# Altium schematic sheet Mobile_device_sheet5_power_supply.SchDoc
size A4; SheetNumber: 4; SheetTotal: 5
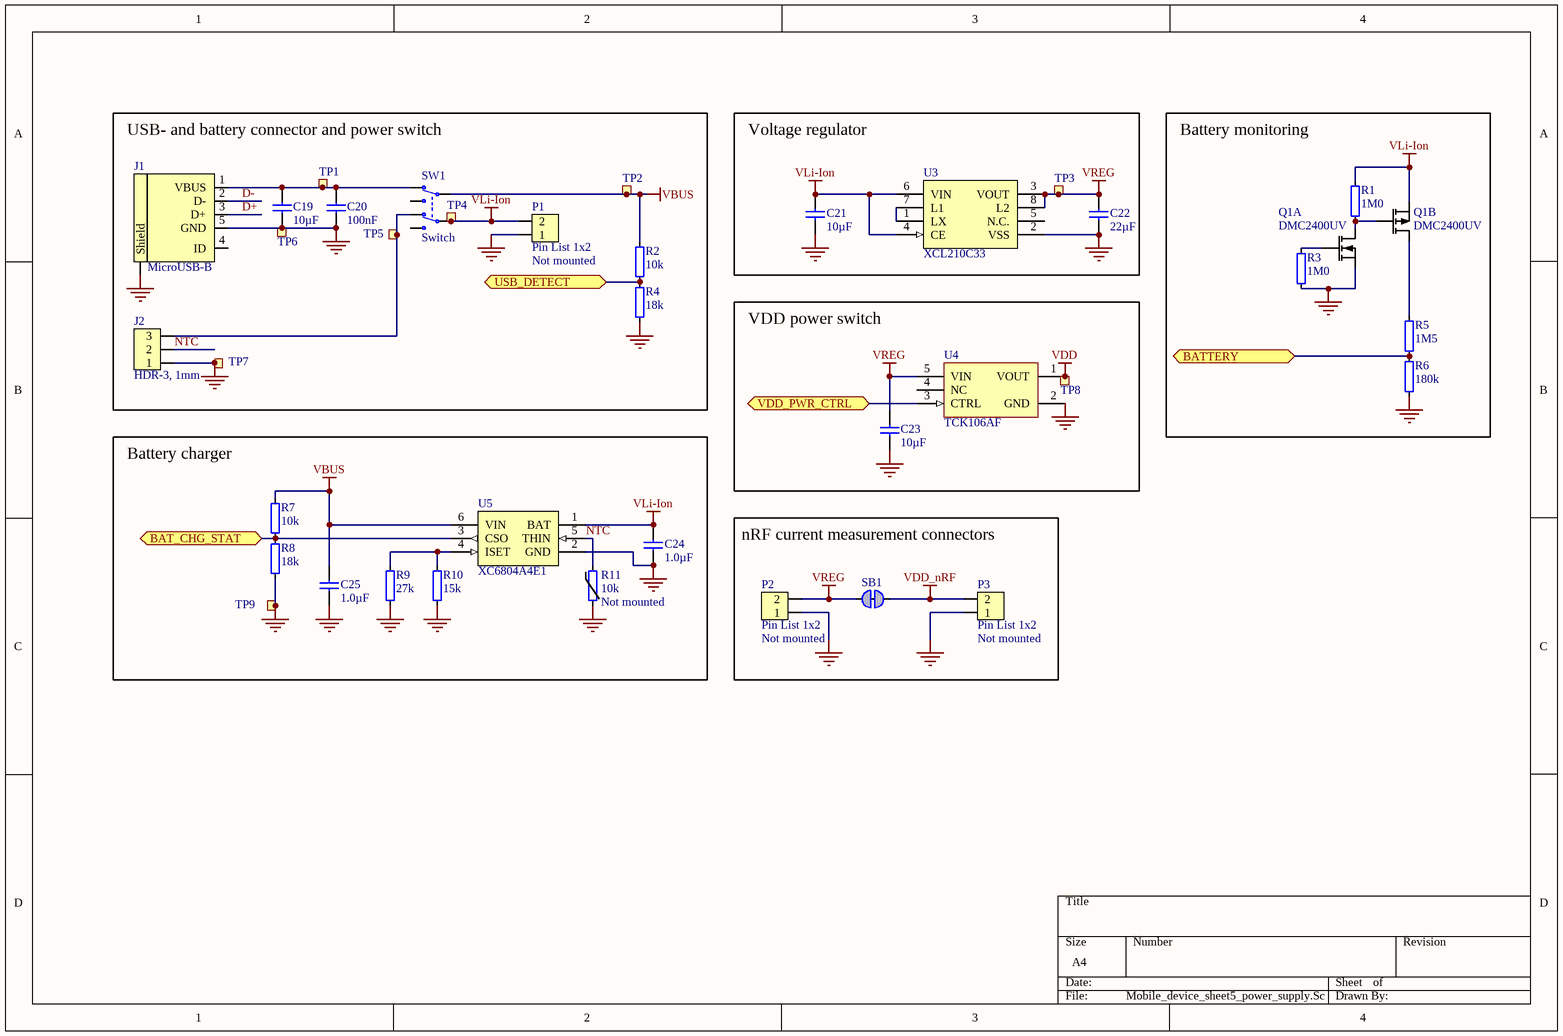
[diagram p0: Mobile_device_sheet5_power_supply.SchDoc]

## Parts
C19  10µF  [CAPC1608X06L]
C20  100nF  [CAPC1005X04L]
C21  10µF  [CAPC1608X06L]
C22  22µF  [CAPC1608X06L]
C23  10µF  [CAPC1608X06L]
C24  1.0µF  [CAPC1608X06L]
C25  1.0µF  [CAPC1608X06L]
J1  MicroUSB-B  [USB-Micro-B-RA-SMD-PiP]
J2  HDR-3, 1mm  [SM03B-SRSS-TB]
P1  Pin List 1x2  Assembly: Not mounted  [LIST_1x2-NC]
P2  Pin List 1x2  Assembly: Not mounted  [LIST_1x2-NC]
P3  Pin List 1x2  Assembly: Not mounted  [LIST_1x2-NC]
Q1  DMC2400UV  [SOTFL50P162X60-6N]  (parts A,B of 2)
R1  1M0  [RESC1005X04L]
R2  10k  [RESC1005X04L]
R3  1M0  [RESC1005X04L]
R4  18k  [RESC1005X04L]
R5  1M5  [RESC1005X04L]
R6  180k  [RESC1005X04L]
R7  10k  [RESC1005X04L]
R8  18k  [RESC1005X04L]
R9  27k  [RESC1005X04L]
R10  15k  [RESC1005X04L]
R11  10k  Assembly: Not mounted  [RESC1005X04L]
SB1  Solderbridge  [Solderbridge_Shorted]  (value not drawn)  (net tie, no BOM)
SW1  Switch  [Switch-Slide-RA-J-Lead-DPDT-8.5x3.5mm]
TP1  Ø1.5mm,SMD  [TP_SMD_Ø1.5mm]  (value not drawn)  (no BOM)
TP2  Ø1.5mm,SMD  [TP_SMD_Ø1.5mm]  (value not drawn)  (no BOM)
TP3  Ø1.5mm,SMD  [TP_SMD_Ø1.5mm]  (value not drawn)  (no BOM)
TP4  Ø1.5mm,SMD  [TP_SMD_Ø1.5mm]  (value not drawn)  (no BOM)
TP5  Ø1.5mm,SMD  [TP_SMD_Ø1.5mm]  (value not drawn)  (no BOM)
TP6  Ø1.5mm,SMD  [TP_SMD_Ø1.5mm]  (value not drawn)  (no BOM)
TP7  Ø1.5mm,SMD  [TP_SMD_Ø1.5mm]  (value not drawn)  (no BOM)
TP8  Ø1.5mm,SMD  [TP_SMD_Ø1.5mm]  (value not drawn)  (no BOM)
TP9  TP  [TESTPAD-TH]  (value not drawn)  (no BOM)
U3  XCL210C33  [CL-2025]
U4  TCK106AF  [SOT95P280X140-5N]
U5  XC6804A4E1  [USP-6EL]

## Blocks framed on the sheet
USB- and battery connector and power switch: C19 C20 J1 J2 P1 R2 R4 SW1 TP1 TP2 TP4-TP7
Voltage regulator: C21 C22 TP3 U3
Battery monitoring: Q1 R1 R3 R5 R6
VDD power switch: C23 TP8 U4
Battery charger: C24 C25 R7-R11 TP9 U5
nRF current measurement connectors: P2 P3 SB1

## Ports
BAT_CHG_STAT (bidir), BATTERY (bidir), USB_DETECT (bidir), VDD_PWR_CTRL (bidir)

## Nets
GND: C19.2 C20.2 C21.1 C22.1 C23.1 C24.1 C25.1 J1.5(GND) J1.6(Shield) J2.1 P1.1 P2.1 P3.1 Q1.1(S1) R3.2 R4.2 R6.2 R8.2 R9.2 R10.2 R11.2 TP6.1 TP7.1 TP9.1 U3.2(VSS) U3.9(VSS) U4.2(GND) U5.2(GND) U5.7(GND)
VBUS: C25.2 R2.1 R7.1 SW1.2(COM-1) TP2.1 U5.6(VIN)
VDD: TP8.1 U4.1(VOUT)
VDD_nRF: P3.2 SB1.1
VLi-Ion: C21.2 C24.2 P1.2 Q1.4(S2) R1.1 SW1.5(COM-2) TP4.1 U3.4(CE) U3.6(VIN) U5.1(BAT)
VREG: C22.2 C23.2 P2.2 SB1.2 TP3.1 U3.3(VOUT) U3.8(L2) U4.5(VIN)
BAT_CHG_STAT: R7.2 R8.1 U5.3(CSO) ; port BAT_CHG_STAT
BATTERY: R5.2 R6.1 ; port BATTERY
D+: J1.3(D+)
D-: J1.2(D-)
NTC: J2.2 R11.1 U5.5(THIN)
USB_DETECT: R2.2 R4.1 ; port USB_DETECT
VDD_PWR_CTRL: U4.3(CTRL) ; port VDD_PWR_CTRL
NetC19_1: C19.1 C20.1 J1.1(VBUS) SW1.3(N.C-1) TP1.1
NetJ2_3: J2.3 SW1.6(N.C-2) TP5.1
NetQ1_2: Q1.2(G1) R3.1
NetQ1_3: Q1.3(D2) R5.1
NetQ1_5: Q1.5(G2) Q1.6(D1) R1.2
NetR9_1: R9.1 R10.1 U5.4(ISET)
NetU3_1: U3.1(LX) U3.7(L1)

Not connected (* = marked no-connect by the designer): J1 4(ID); SW1 1(N.O-1) 4(N.O-2); U3 5(N.C.); U4 4(NC)

## Library data of the parts
C19 C21 C23 = C0603-10µ: Capacitor, X5R, ±20%; Part number IPS: 00000007785; Note: 6.3V; Artikkelnr Noca: 20039234; Part Number: C0603-10µ; Manufacturer: *; Manufacturer Part Number: *; LatestRevisionDate: 2011-01-17; Pin Count: 2; Publisher: Nordic Semiconductor; Published: 2011-01-17; Value: 10µF; Footprint Doc: 0603; ComponentLink1URL: *; ComponentLink1Description: Datasheet; ComponentLink2URL: *; ComponentLink2Description: Supplier link; HelpURL: *; Supplier 1: *; Supplier Part Number 1: *; Supplier 2: *; Supplier Part Number 2: *
C20 = C0402-100n: Capacitor, X7R, ±10%; Part number IPS: 00000005296; Note: 16V; Artikkelnr Noca: 20039200; Part Number: C0402-100n; Manufacturer: *; Manufacturer Part Number: *; LatestRevisionDate: 2009-11-23; Pin Count: 2; Publisher: Nordic Semiconductor; Published: 2009-05-08; Value: 100nF; Footprint Doc: 0402; ComponentLink1URL: *; ComponentLink1Description: Datasheet; ComponentLink2URL: *; ComponentLink2Description: Supplier link; HelpURL: *; Supplier 1: *; Supplier Part Number 1: *; Supplier 2: *; Supplier Part Number 2: *
C22 = C0603-22µ-6.3V: CAP CER 22UF 6.3V 20% X5R 0603; Manufacturer: Samsung; Manufacturer Part Number: CL10A226MQ8NRNC; Part number IPS: 00000007787; Artikkelnr Noca: N.A.; Part Number: C0603-22µ-6.3V; Footprint Doc: 0603; LatestRevisionDate: 2015-04-10; Pin Count: 2; Publisher: Nordic Semiconductor; Published: 2015-04-10; Value: 22µF; Note: 6.3V; ComponentLink1URL: *; ComponentLink1Description: Datasheet; ComponentLink2URL: *; ComponentLink2Description: Supplier link; HelpURL: http://www.samsungsem.com/kr/front/downloadcms.do?path=/kr/support/product-search/mlcc/__icsFiles/afieldfile/2014/11/05&fileName=S_CL10A226MQ8NRNC.pdf; Supplier 1: Digi-Key; Supplier Part Number 1: 1276-1193-1-ND; Supplier 2: *; Supplier Part Number 2: *
C24 C25 = C0603-1µ0: Capacitor, X7R, ±10%; Part number IPS: 00000000616; Note: 16V; Artikkelnr Noca: 20039282; Part Number: C0603-1µ0; Manufacturer: *; Manufacturer Part Number: *; Footprint Doc: 0603; LatestRevisionDate: 2013-06-05; Pin Count: 2; Publisher: Nordic Semiconductor; Published: 2009-05-08; Value: 1.0µF; ComponentLink1URL: *; ComponentLink1Description: Datasheet; ComponentLink2URL: *; ComponentLink2Description: Supplier link; HelpURL: *; Supplier 1: *; Supplier Part Number 1: *; Supplier 2: *; Supplier Part Number 2: *
J1 = USB-Micro-B-RA-SMD-PiP: MicroUSB-B-SMT; Manufacturer: Allen Creations Corp.; Manufacturer Part Number: AJU55-BS2111-L; Part number IPS: 00000007790; Artikkelnr Noca: 55029020; Part Number: USB-Micro-B-RA-SMD-PiP; Footprint Doc: USB-Micro-B-RA-SMD-PiP; LatestRevisionDate: 2016-04-21; Pin Count: 5; Publisher: Nordic Semiconductor; Published: 2014-10-07; Value: MicroUSB-B; Note: *; ComponentLink1URL: *; ComponentLink1Description: Datasheet; ComponentLink2URL: *; ComponentLink2Description: Supplier link; HelpURL: \\hizz\pro\app9717\Datasheet\connectores\Allen Creations Corp\AJU-211.pdf; Supplier 1: Cabcon; Supplier Part Number 1: AJU55-BS2111-L; Supplier 2: Digi-Key; Supplier Part Number 2: 609-4616-1-ND
J2 = SM03B-SRSS-TB: 1.0mm pitch connector side entry SMD; Manufacturer: JST; Manufacturer Part Number: SM03B-SRSS-TB(LF)(SN); Part number IPS: 00000001785; Note: JST, Header; Artikkelnr Noca: N.A.; Part Number: SM03B-SRSS-TB; Footprint Doc: SM03B-SRSS-TB; LatestRevisionDate: 2017-10-09; Pin Count: 3; Publisher: Nordic Semiconductor; Published: 2017-10-09; Value: HDR-3, 1mm; ComponentLink1URL: *; ComponentLink1Description: Datasheet; ComponentLink2URL: *; ComponentLink2Description: Supplier link; HelpURL: http://www.jst-mfg.com/product/pdf/eng/eSH.pdf; Supplier 1: Digi-Key; Supplier Part Number 1: 455-1803-1-ND; Supplier 2: *; Supplier Part Number 2: *
P1-P3 = Pin List 1x2, N.C.: Pin List 1x2, 2.54mm (100mil); Artikkelnr Noca: N.A.; Part Number: Pin List 1x2, N.C.; Manufacturer: *; Manufacturer Part Number: *; Footprint Doc: LIST_1x2; LatestRevisionDate: 2017-02-02; Pin Count: 2; Publisher: Nordic Semiconductor; Published: 2017-01-30; Value: Pin List 1x2; Note: *; Part number IPS: N.A.; ComponentLink1URL: *; ComponentLink1Description: Datasheet; ComponentLink2URL: *; ComponentLink2Description: Supplier link; HelpURL: *; Supplier 1: *; Supplier Part Number 1: *; Supplier 2: *; Supplier Part Number 2: *
Q1 = DMC2400UV: Dual N & P Ch MOFET, 1.03A/0.7A, 480mOhm, 450mW; Manufacturer: Diodes Incorporated; Part number IPS: 00000007803; Note: Dual N & P Channel Digital FET; Artikkelnr Noca: N.A.; Part Number: DMC2400UV; Manufacturer Part Number: DMC2400UV; Footprint Doc: SOT-563; LatestRevisionDate: 2016-01-18; Pin Count: 6; Publisher: Nordic Semiconductor; Published: 2016-01-18; Value: DMC2400UV; Supplier 1: Digi-Key; Supplier Part Number 1: DMC2400UV-7DICT-ND; Supplier 2: *; Supplier Part Number 2: *; ComponentLink1URL: *; ComponentLink1Description: Datasheet; ComponentLink2URL: *; ComponentLink2Description: Supplier link; HelpURL: http://www.diodes.com/_files/datasheets/DMC2400UV.pdf
R1 R3 = R0402-1M0: Resistor, ±1%, 0.063W; Part number IPS: 00000006807; Note: Chip Res 1%; Artikkelnr Noca: 27049145; Part Number: R0402-1M0; Manufacturer: *; Manufacturer Part Number: *; LatestRevisionDate: 2009-11-23; Pin Count: 2; Publisher: Nordic Semiconductor; Published: 2009-05-08; Value: 1M0; Footprint Doc: 0402; ComponentLink1URL: *; ComponentLink1Description: Datasheet; ComponentLink2URL: *; ComponentLink2Description: Supplier link; HelpURL: *; Supplier 1: *; Supplier Part Number 1: *; Supplier 2: *; Supplier Part Number 2: *
R2 R7 = R0402-10k: Resistor, ±1%, 0.063W; Part number IPS: 00000002093; Note: Chip Res 1%; Artikkelnr Noca: 27049097; Part Number: R0402-10k; Manufacturer: *; Manufacturer Part Number: *; LatestRevisionDate: 2009-11-23; Pin Count: 2; Publisher: Nordic Semiconductor; Published: 2009-05-08; Value: 10k; Footprint Doc: 0402; ComponentLink1URL: *; ComponentLink1Description: Datasheet; ComponentLink2URL: *; ComponentLink2Description: Supplier link; HelpURL: *; Supplier 1: Farnell; Supplier Part Number 1: 173-8864; Supplier 2: *; Supplier Part Number 2: *
R4 R8 = R0402-18k: Resistor, ±1%, 0.063W; Part number IPS: 00000003300; Note: Chip Res 1%; Artikkelnr Noca: 27049103; Part Number: R0402-18k; Manufacturer: *; Manufacturer Part Number: *; LatestRevisionDate: 2009-11-23; Pin Count: 2; Publisher: Nordic Semiconductor; Published: 2009-05-08; Value: 18k; Footprint Doc: 0402; ComponentLink1URL: *; ComponentLink1Description: Datasheet; ComponentLink2URL: *; ComponentLink2Description: Supplier link; HelpURL: *; Supplier 1: Farnell; Supplier Part Number 1: 173-8867; Supplier 2: *; Supplier Part Number 2: *
R5 = R0402-1M5: Resistor, ±1%, 0.063W; Part number IPS: 00000007809; Note: Chip Res 1%; Artikkelnr Noca: 27049149; Part Number: R0402-1M5; Manufacturer: *; Manufacturer Part Number: *; LatestRevisionDate: 2009-11-23; Pin Count: 2; Publisher: Nordic Semiconductor; Published: 2009-05-08; Value: 1M5; Footprint Doc: 0402; ComponentLink1URL: *; ComponentLink1Description: Datasheet; ComponentLink2URL: *; ComponentLink2Description: Supplier link; HelpURL: *; Supplier 1: *; Supplier Part Number 1: *; Supplier 2: *; Supplier Part Number 2: *
R6 = R0402-180k: Resistor, ±1%, 0.063W; Part number IPS: 00000007810; Note: Chip Res 1%; Artikkelnr Noca: 27049127; Part Number: R0402-180k; Manufacturer: *; Manufacturer Part Number: *; LatestRevisionDate: 2009-11-23; Pin Count: 2; Publisher: Nordic Semiconductor; Published: 2009-05-08; Value: 180k; Footprint Doc: 0402; ComponentLink1URL: *; ComponentLink1Description: Datasheet; ComponentLink2URL: *; ComponentLink2Description: Supplier link; HelpURL: *; Supplier 1: *; Supplier Part Number 1: *; Supplier 2: *; Supplier Part Number 2: *
R9 = R0402-27k: Resistor, ±1%, 0.063W; Part number IPS: 00000004188; Note: Chip Res 1%; Artikkelnr Noca: 27049107; Part Number: R0402-27k; Manufacturer: *; Manufacturer Part Number: *; LatestRevisionDate: 2009-11-23; Pin Count: 2; Publisher: Nordic Semiconductor; Published: 2009-05-08; Value: 27k; Footprint Doc: 0402; ComponentLink1URL: *; ComponentLink1Description: Datasheet; ComponentLink2URL: *; ComponentLink2Description: Supplier link; HelpURL: *; Supplier 1: Farnell; Supplier Part Number 1: 173-8869; Supplier 2: *; Supplier Part Number 2: *
R10 = R0402-15k: Resistor, ±1%, 0.063W; Part number IPS: 00000002098; Note: Chip Res 1%; Artikkelnr Noca: 27049101; Part Number: R0402-15k; Manufacturer: *; Manufacturer Part Number: *; LatestRevisionDate: 2009-11-23; Pin Count: 2; Publisher: Nordic Semiconductor; Published: 2009-05-08; Value: 15k; Footprint Doc: 0402; ComponentLink1URL: *; ComponentLink1Description: Datasheet; ComponentLink2URL: *; ComponentLink2Description: Supplier link; HelpURL: *; Supplier 1: Farnell; Supplier Part Number 1: 173-8866; Supplier 2: *; Supplier Part Number 2: *
R11 = NCP15XH103F03RC: THERMISTOR 10K OHM NTC 0402 SMD; Manufacturer: Murata; Part number IPS: 00000007808; Note: Chip Res 1%; Artikkelnr Noca: N.A.; Part Number: NCP15XH103F03RC; Manufacturer Part Number: NCP15XH103F03RC; LatestRevisionDate: 2015-03-25; Pin Count: 2; Publisher: Nordic Semiconductor; Published: 2015-03-25; Value: 10k; Footprint Doc: 0402; ComponentLink1URL: *; ComponentLink1Description: Datasheet; ComponentLink2URL: *; ComponentLink2Description: Supplier link; HelpURL: *; Supplier 1: Digi-Key; Supplier Part Number 1: 490-4801-1-ND; Supplier 2: Farnell; Supplier Part Number 2: 245-6121
SB1 = Solderbridge Shorted: Shorted Solderbridge; Artikkelnr Noca: N.A.; Part Number: Solderbridge Shorted; Manufacturer: *; Manufacturer Part Number: *; Footprint Doc: Solderbridge_Shorted; LatestRevisionDate: 2012-08-07; Pin Count: 2; Publisher: Nordic Semiconductor; Published: 2012-08-07; Value: Solderbridge; Note: *; Part number IPS: N.A.; ComponentLink1URL: *; ComponentLink1Description: Datasheet; ComponentLink2URL: *; ComponentLink2Description: Supplier link; HelpURL: *; Supplier 1: *; Supplier Part Number 1: *; Supplier 2: *; Supplier Part Number 2: *
SW1 = Switch-Slide-RA-J-Lead-DPDT-8.5x3.5mm_C&K: SMD slide Switch (ON-ON); Manufacturer: C&K Components; Manufacturer Part Number: JS202011JAQN; Part number IPS: 00000007811; Artikkelnr Noca: N.A.; Part Number: Switch-Slide-RA-J-Lead-DPDT-8.5x3.5mm_C&K; Footprint Doc: Switch-Slide-RA-J-Lead-DPDT-8.5x3.5mm; LatestRevisionDate: 2017-02-01; Pin Count: 6; Publisher: Nordic Semiconductor; Published: 2016-09-15; Value: Switch; Note: *; ComponentLink1URL: *; ComponentLink1Description: Datasheet; ComponentLink2URL: *; ComponentLink2Description: Supplier link; HelpURL: http://www.ck-components.com/media/1422/js.pdf; Supplier 1: Digi-Key; Supplier Part Number 1: CKN10722CT-ND; Supplier 2: Mouser; Supplier Part Number 2: 611-JS202011JAQN
TP1-TP8 = TP_SMD_Ø1.5MM: 1.0mm circular SMD testpad; Manufacturer: Nordic Semiconductor; Artikkelnr Noca: N.A.; Part Number: TP_SMD_Ø1.5MM; Manufacturer Part Number: *; Footprint Doc: TP_SMD_Ø1.5mm; LatestRevisionDate: 2016-06-02; Pin Count: 1; Publisher: Nordic Semiconductor; Published: 2016-06-02; Value: Ø1.5mm,SMD; Note: *; Part number IPS: N.A.; ComponentLink1URL: *; ComponentLink1Description: Datasheet; ComponentLink2URL: *; ComponentLink2Description: Supplier link; HelpURL: *; Supplier 1: *; Supplier Part Number 1: *; Supplier 2: *; Supplier Part Number 2: *
TP9 = Testpoint TH: Testpoint, through hole; Artikkelnr Noca: N.A.; Part Number: Testpoint TH; Manufacturer: *; Manufacturer Part Number: *; Footprint Doc: TESTPAD-TH; LatestRevisionDate: 2009-12-12; Pin Count: 1; Publisher: Nordic Semiconductor; Published: 2009-12-12; Value: TP; Note: *; Part number IPS: N.A.; ComponentLink1URL: *; ComponentLink1Description: Datasheet; ComponentLink2URL: *; ComponentLink2Description: Supplier link; HelpURL: *; Supplier 1: *; Supplier Part Number 1: *; Supplier 2: *; Supplier Part Number 2: *
U3 = XCL210C33: 3.3V 200mA Inductor Built-in Step-Down “micro DC/DC” Converter; Manufacturer: Torex Semiconductor; Part number IPS: 00000007826; Artikkelnr Noca: N.A.; Part Number: XCL210C33; Manufacturer Part Number: XCL210C33; Footprint Doc: CL-2025; LatestRevisionDate: 2017-01-30; Pin Count: 8; Publisher: Nordic Semiconductor; Published: 2016-09-29; Value: XCL210C33; Note: *; ComponentLink1URL: *; ComponentLink1Description: Datasheet; ComponentLink2URL: *; ComponentLink2Description: Supplier link; HelpURL: https://www.torexsemi.com/file/xcl210/XCL210.pdf; Supplier 1: *; Supplier Part Number 1: *; Supplier 2: *; Supplier Part Number 2: *
U4 = TCK106AF,LF: 1.0 A Load Switch IC with Slew Rate Control Driver in Small Package; Manufacturer: Toshiba; Part number IPS: 00000007823; Artikkelnr Noca: 15070086; Part Number: TCK106AF,LF; Manufacturer Part Number: TCK106AF,LF; Footprint Doc: SOT-25; LatestRevisionDate: 2016-09-29; Pin Count: 5; Publisher: Nordic Semiconductor; Published: 2016-09-29; Value: TCK106AF; Note: *; Supplier 1: Digi-Key; Supplier Part Number 1: TCK106AFLFCT-ND; Supplier 2: *; Supplier Part Number 2: *; ComponentLink1URL: *; ComponentLink1Description: Datasheet; ComponentLink2URL: *; ComponentLink2Description: Supplier link; HelpURL: https://toshiba.semicon-storage.com/info/docget.jsp?did=53240&prodName=TCK108AF
U5 = XC6804A4E14R-G: One Cell Li-ion/Li-polymer Linear Charger IC with Battery Temperature Detection; Manufacturer: Torex Semiconductor; Part number IPS: 00000007825; Artikkelnr Noca: N.A.; Part Number: XC6804A4E14R-G; Manufacturer Part Number: XC6804A4E14R-G; Footprint Doc: USP-6EL; LatestRevisionDate: 2016-09-29; Pin Count: 6; Publisher: Nordic Semiconductor; Published: 2016-09-29; Value: XC6804A4E1; Note: *; ComponentLink1URL: *; ComponentLink1Description: Datasheet; ComponentLink2URL: *; ComponentLink2Description: Supplier link; HelpURL: https://www.torexsemi.com/file/xc6804/XC6804.pdf; Supplier 1: Digi-Key; Supplier Part Number 1: 893-1312-1-ND; Supplier 2: Mouser; Supplier Part Number 2: 865-XC6804A4E14R-G